# EAGLE design pt4115 (EAGLE 6.6.0)
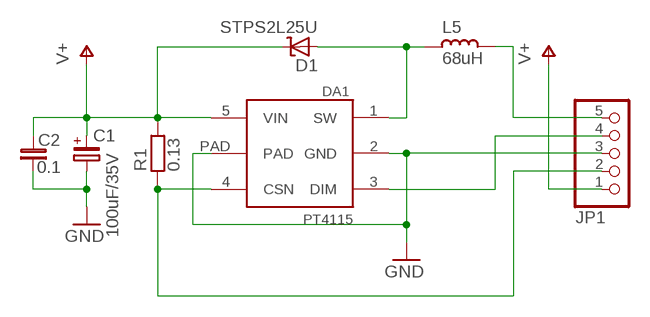
[diagram p0: schematic, sheet 1]

## Parts
C1  100uF/35V  CP_E-025X060  [CE-025X060]
C2  0.1  C_0805  [C0805]
D1  STPS2L25U  [SMB_1]
DA1  PT4115  [SOT89-5]
JP1  PINHD-1X5_2.54-90°  [1X05/90]
L5  68uH  L_CD54  [CD54]
R1  0.13  R_1206  [R1206]

## Nets
GND: C1.- C2.2 DA1.2(GND) DA1.PAD JP1.3
N$1: DA1.4(CSN) JP1.2 R1.1
N$2: JP1.5 L5.1
N$3: DA1.3(DIM) JP1.4
SW4: D1.A DA1.1(SW) L5.2
V+: C1.+ C2.1 D1.C DA1.5(VIN) JP1.1 R1.2

## Library data of the parts
C1 = rc-master:CP_: POLARIZED CAP
C2 = rc-master-smd:C_: NON-POLARIZED CAP
D1 = diodes:STPS2L25: Low drop power Schottky rectifier IF(AV) 2A VRRM 25 V Tj (max) 150° C VF(max) 0.375 V
DA1 = pt4115:PT4115: Small switching mode constant current PS
JP1 = pinhead-fixdrills:PINHD-1X5: PIN HEADER
L5 = rc-master-smd:L_: INDUCTOR
R1 = rc-master-smd:R_: RESISTOR

## Board
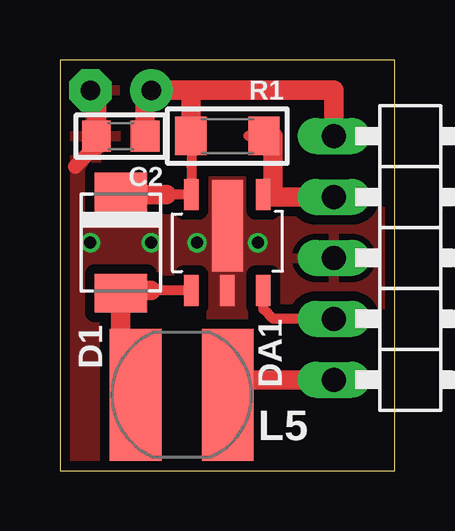
[diagram p1: board, top side]
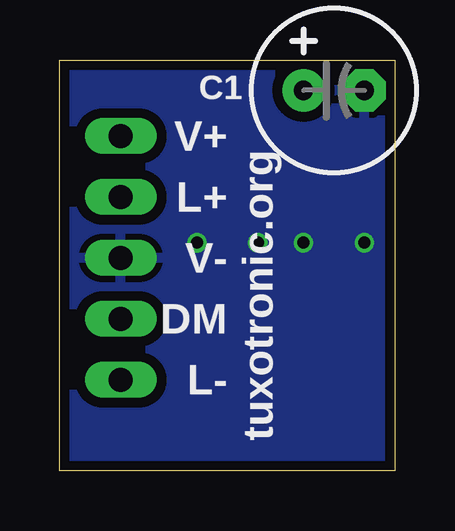
[diagram p2: board, bottom side, seen from below]

Size 13.97 x 17.14 mm. Coordinates in mm from the lower left corner, seen from the top.
Outline: 0,0 13.97,0 13.97,17.14 0,17.14 0,0
Copper layers (1*16): Top 0.035mm / dielectric 1.5mm / Bottom 0.035mm
Design rules "ITEADstudio_DRC": minimum track width 6mil, minimum drill 12mil, track to track 6mil, track to pad 6mil, pad to pad 6mil, via to via 6mil, smd to smd 0mil, copper to edge 10mil, drill to drill 10mil, minimum pad ring 10mil, minimum via ring 6mil, stop-mask expansion 2mil, vias tented up to drill 100mil, thermal gap 10mil
tRestrict: area 4.4,0.9 to 5.7,5.4; area 6.3,12.7 to 7.6,15.2

### Footprints (pad centres in the part's own frame; a part is rotated, then mirrored left to right if it is on the bottom)
CE-025X060 = drill 0.8 pad 1.778: + -1.27,0 | drill 0.8 pad 1.778 octagon: - 1.27,0
C0805 = smd 1.2 x 1.3: 1 -1.016,0; 2 1.016,0
SMB_1 = smd 1.62 x 2.18: A 2.11,0; C -2.11,0
SOT89-5 = smd 0.6 x 1.3: 1 -1.5,-2; 2 0,-2; 3 1.5,-2; 4 1.5,2; 5 -1.5,2 | smd 1.3 x 3.8: PAD 0,0.7
1X05/90 = drill 1 long: 1 -5.08,-3.81; 2 -2.54,-3.81; 3 0,-3.81; 4 2.54,-3.81; 5 5.08,-3.81
CD54 = smd 5.5 x 2.15: 1 0,1.925; 2 0,-1.925
R1206 = smd 1.3 x 1.6: 1 -1.524,0; 2 1.524,0

### Placement (x,y rotation side)
C1  2.54,15.88 0 bottom
C2  2.54,13.97 180 top
D1  2.54,9.53 270 top
DA1  6.99,9.53 0 top
JP1  15.24,8.89 270 top
L5  5.08,3.17 270 top
R1  6.99,13.97 180 top

### Tracks (layer width: path | path; a pad name or v marks a point on that pad's centre or on a via)
GND  (via drill 0.5)
  Top 0.61: 1.52,13.59 0.64,12.7
  Top 0.813: C1.- 1.52,15.62 C2.2 1.52,13.59
  other vias: 1.27,9.53 3.81,9.53 5.71,9.53 8.26,9.53
  pour Top (isolate 0.406): 0,17.14 13.97,17.14 13.97,0 0,0
  pour Bottom (isolate 0.406): 0,17.14 13.97,17.14 13.97,0 0,0
N$1
  Top 0.406: R1.1 7.85,13.97 | DA1.4 8.89,11.53
  Top 0.813: JP1.2 8.89,11.43 8.89,11.53 8.89,13.97 R1.1
N$2
  Top 0.813: L5.1 6.99,3.17 7.62,3.81 JP1.5
N$3
  Top 0.406: JP1.4 8.89,6.35 8.48,6.75 DA1.3
SW4
  Top 0.406: DA1.1 3.81,7.53
  Top 0.813: L5.2 2.54,5.71 D1.A 2.54,7.53 3.81,7.53
V+
  Top 0.406: R1.2 5.49,12.7 DA1.5 4.45,11.53
  Top 0.813: JP1.1 11.43,15.88 5.46,15.88 | 5.46,15.88 R1.2 | 5.46,15.88 C1.+ 3.56,15.62 C2.1 | 4.45,11.53 2.54,11.53 D1.C

### Text on the board
bPlace: V+ | L+ | V- | DM | L- | tuxotronic.org